# Altium schematic sheet HDC2022.SchDoc
size A4; Organization: Altium Limited; Address1: L3, 12a Rodborough Rd; Address2: Frenchs Forest; Address3: NSW; Address4: Australia 2086; DocumentNumber: 1; Revision: v1.0.0; SheetNumber: 1; SheetTotal: 1
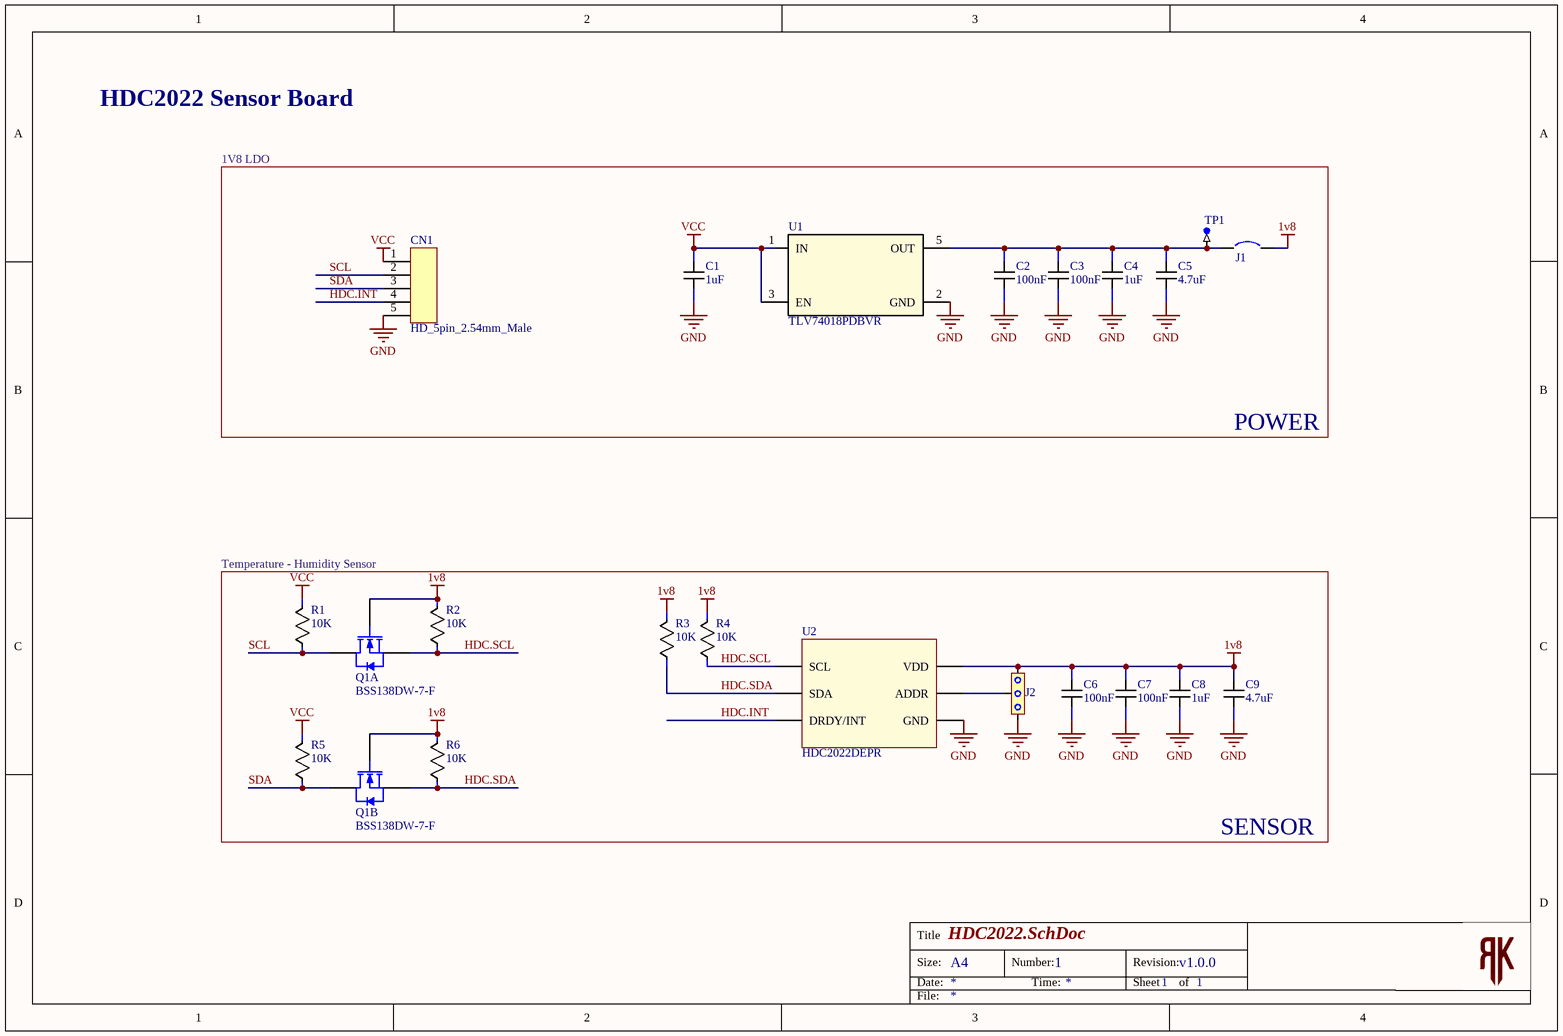
[diagram p0: HDC2022.SchDoc]

## Parts
C1  1uF  [CAP_0603]
C2  100nF  [CAP_0603]
C3  100nF  [CAP_0603]
C4  1uF  [CAP_0603]
C5  4.7uF  [CAP_0603]
C6  100nF  [CAP_0603]
C7  100nF  [CAP_0603]
C8  1uF  [CAP_0603]
C9  4.7uF  [CAP_0603]
CN1  HD_5pin_2.54mm_Male  [HD_5pin_2.54mm_male]
J1  Jumper  [SB_0603]  (value not drawn)  (no BOM)
J2  JUMPER_3Pin  [SB_0603 - 3 Pin]  (value not drawn)  (no BOM)
Q1  BSS138DW-7-F  [DIOD-SOT363-6_V]  (parts A,B of 2)
R1  10K  [RES_0603]
R2  10K  [RES_0603]
R3  10K  [RES_0603]
R4  10K  [RES_0603]
R5  10K  [RES_0603]
R6  10K  [RES_0603]
TP1  Test Point  [TP]  (value not drawn)  (no BOM)
U1  TLV74018PDBVR  [SOIC_DBVR_TEX]
U2  HDC2022DEPR  [WSON-6]

## Blocks framed on the sheet
POWER: C1-C5 CN1 J1 TP1 U1
SENSOR: C6-C9 J2 Q1 R1-R6 U2

## Nets
1v8: C6.2 C7.2 C8.2 C9.2 J1.2 J2.1 Q1.2(G1) Q1.5(G2) R2.2 R3.2 R4.2 R6.2 U2.5(VDD)
GND: C1.1 C2.1 C3.1 C4.1 C5.1 C6.1 C7.1 C8.1 C9.1 CN1.5 J2.3 U1.2(GND) U2.2(GND)
VCC: C1.2 CN1.1 R1.2 R5.2 U1.1(IN) U1.3(EN)
HDC.INT: CN1.4 U2.4(DRDY/INT)
HDC.SCL: Q1.1(S1) R2.1 R4.1 U2.6(SCL)
HDC.SDA: Q1.4(S2) R3.1 R6.1 U2.1(SDA)
SCL: CN1.2 Q1.6(D1) R1.1
SDA: CN1.3 Q1.3(D2) R5.1
NetC2_2: C2.2 C3.2 C4.2 C5.2 J1.1 TP1.1 U1.5(OUT)
NetJ2_2: J2.2 U2.3(ADDR)

Not connected (* = marked no-connect by the designer): U1 4(NC)

## Notes on the sheet
- HDC2022 Sensor Board
- 1V8 LDO
- Temperature - Humidity Sensor
- Title
- Size:
- Date:
- A4
- Number:
- Time:
- Revision:
- Sheet
- of
- File:

## Library data of the parts
C1-C9 = Capacitor
Q1 = CMP-2000-05966-2: Dual N-Channel Enhancement Mode Field Effect Transistor, 50 V, 200 mA, -55 to 150 degC, 6-Pin SOT-363, RoHS, Tape and Reel; Manufacturer: DiodesIncorporated; RevisionId: 1; Transistor Type: 2N-Channel; Typical Turn-On Delay Time: 20ns; Pd - Power Dissipation: 200mW; Vds - Drain-Source Breakdown Voltage: 50V; Unit Weight: 0.000212oz; Folder: Unified Components\Components\New Releases\New\; ContentType: Unified Component; Id - Continuous Drain Current: 200mA; Vgs - Gate-Source Voltage: 20V; AccessRights: 2147483647; Rds On - Drain-Source Resistance: 3.5Ohms; Number of Channels: 2Channel; ReleaseDate: 30/08/2017 08:55:44 AM; Width: 1.35mm; Manufacturer URL: http://www.diodes.com/; Height: 1mm; LifeCycle: Released; Mounting Technology: SurfaceMount; Product: MOSFETSmallSignal; RoHS: True; ItemGUID: D038B86C-7A34-4742-AE06-400EAE30903C; Mounting Style: SMD/SMT; FolderGUID: B7F4506A-9127-42E7-A087-46FE7B18D116; LifeCycleStateGUID: 61E382EE-6656-4F12-9E24-BE9327104A25; Package Reference: SOT363-6; Minimum Operating Temperature: -55C; Datasheet URL: http://www.diodes.com/_files/datasheets/ds30203.pdf; Series: BSS138; Product Category: MOSFET; Brand: DiodesIncorporated; Packaging: Reel; Configuration: Dual; Package / Case: SOT-363-6; ItemHRID: CMP-2000-05966; Typical Turn-Off Delay Time: 20ns; Factory Pack Quantity: 3000; Transistor Polarity: N-Channel; Package Description: 6-Pin Small Outline Transistor, Body 1.25 x 2 mm, Pitch 0.65 mm; Maximum Operating Temperature: +150C; Channel Mode: Enhancement; Technology: Si; Length: 2.2mm; Datasheet Version: Rev. 13-2, 01/2014; ContentTypeGUID: CB3C11C4-E317-11DF-B822-12313F0024A2
R1-R6 = Resistor
U1 = TLV74018PDBVR: Manufacturer: Texas Instruments; Supplier 1: Digi-Key; Manufacturer Part Number: TLV74018PDBVR; RoHS: No; Stock 1: 4366; Pricing 1: 1=0,24000, 10=0,19400, 25=0,16200, 100=0,09000, 250=0,07920, 500=0,06750, 1000=0,04590 (USD); Supplier Part Number 1: 296-TLV74018PDBVRCT-ND
U2 = HDC2022DEPR: Manufacturer: Texas Instruments; Supplier 1: Digi-Key; Manufacturer Part Number: HDC2022DEPR; RoHS: No; Stock 1: 2745; Pricing 1: 1=4,49000, 5=3,96000, 10=3,49800, 25=2,83800, 50=2,50800, 100=2,44200, 500=2,04600, 1000=1,91400 (USD); Supplier Part Number 1: 296-HDC2022DEPRCT-ND
J1 = Jumper: Published: 24-Mar-1999; Revision: July-2002: Re-released for DXP Platform.; Publisher: Altium Limited